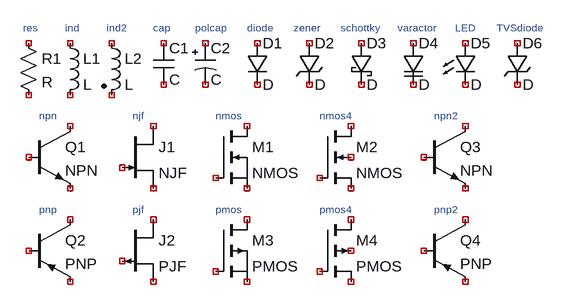
[diagram p0: schematic DIN EN 60617 Symbol Test.asc]
DIN EN 60617 Symbol Test.asc, the LTspice schematic file:
Version 4
SHEET 1 880 680
SYMBOL res -144 16 R0
SYMATTR InstName R1
SYMBOL cap 64 32 R0
SYMATTR InstName C1
SYMBOL polcap 128 32 R0
SYMATTR InstName C2
SYMBOL ind -80 16 R0
SYMATTR InstName L1
SYMBOL ind2 -16 16 R0
SYMATTR InstName L2
SYMBOL diode 208 32 R0
SYMATTR InstName D1
SYMBOL zener 288 32 R0
SYMATTR InstName D2
SYMBOL schottky 368 32 R0
SYMATTR InstName D3
SYMBOL varactor 448 32 R0
SYMATTR InstName D4
SYMBOL npn -128 160 R0
SYMATTR InstName Q1
SYMBOL pnp -128 304 R0
SYMATTR InstName Q2
SYMBOL njf 16 160 R0
SYMATTR InstName J1
SYMBOL pjf 16 304 R0
SYMATTR InstName J2
SYMBOL nmos 160 160 R0
SYMATTR InstName M1
SYMBOL nmos4 320 160 R0
SYMATTR InstName M2
SYMBOL pmos 160 304 R0
SYMATTR InstName M3
SYMBOL pmos4 320 304 R0
SYMATTR InstName M4
SYMBOL LED 528 32 R0
SYMATTR InstName D5
SYMBOL TVSdiode 608 32 R0
SYMATTR InstName D6
SYMBOL npn2 480 160 R0
SYMATTR InstName Q3
SYMBOL pnp2 480 304 R0
SYMATTR InstName Q4
TEXT -136 8 Left 1 ;res
TEXT -72 8 Left 1 ;ind
TEXT -8 8 Left 1 ;ind2
TEXT 64 8 Left 1 ;cap
TEXT 128 8 Left 1 ;polcap
TEXT 208 8 Left 1 ;diode
TEXT 280 8 Left 1 ;zener
TEXT 352 8 Left 1 ;schottky
TEXT 440 8 Left 1 ;varactor
TEXT 528 8 Left 1 ;LED
TEXT 592 8 Left 1 ;TVSdiode
TEXT -112 144 Left 1 ;npn
TEXT -112 288 Left 1 ;pnp
TEXT 32 144 Left 1 ;njf
TEXT 32 288 Left 1 ;pjf
TEXT 160 144 Left 1 ;nmos
TEXT 160 288 Left 1 ;pmos
TEXT 320 144 Left 1 ;nmos4
TEXT 320 288 Left 1 ;pmos4
TEXT 496 144 Left 1 ;npn2
TEXT 496 288 Left 1 ;pnp2

The netlist it stands for:
* DIN EN 60617 Symbol Test.asc
R1 NC_01 NC_02 R
C1 NC_03 NC_04 C
C2 NC_05 NC_06 C
L1 NC_07 NC_08 L
L2 NC_09 NC_10 L
D1 NC_11 NC_12 D
D2 NC_13 NC_14 D
D3 NC_15 NC_16 D
D4 NC_17 NC_18 D
Q1 NC_19 NC_20 NC_21 0 NPN
Q2 NC_22 NC_23 NC_24 0 PNP
J1 NC_25 NC_26 NC_27 NJF
J2 NC_28 NC_29 NC_30 PJF
M1 NC_31 NC_32 NC_33 NC_33 NMOS
M2 NC_34 NC_35 NC_36 NC_37 NMOS
M3 NC_38 NC_39 NC_40 NC_40 PMOS
M4 NC_41 NC_42 NC_43 NC_44 PMOS
D5 NC_45 NC_46 D
D6 NC_47 NC_48 D
Q3 NC_49 NC_50 NC_51 0 NPN
Q4 NC_52 NC_53 NC_54 0 PNP
.model D D
.lib standard.dio
.model NPN NPN
.model PNP PNP
.lib standard.bjt
.model NJF NJF
.model PJF PJF
.lib standard.jft
.model NMOS NMOS
.model PMOS PMOS
.lib standard.mos
* res
* ind
* ind2
* cap
* polcap
* diode
* zener
* schottky
* varactor
* LED
* TVSdiode
* npn
* pnp
* njf
* pjf
* nmos
* pmos
* nmos4
* pmos4
* npn2
* pnp2
.backanno
.end